# Altium schematic sheet Sheet3.SchDoc: =Name-1str
size 594 x 420 mm; SheetNumber: номер страницы; Вид изделия: Документация; Раздел: Документация; Код документа: Э3; Вид документа: Схема электрическая принципиальная; Класс документа: Конструкторский документ; Создавать изделие в PLM: Yes; DocumentCode: Э3; DocumentView: Схема электрическая принципиальная; DocumentClass: Конструкторский документ; ProductView: Документация
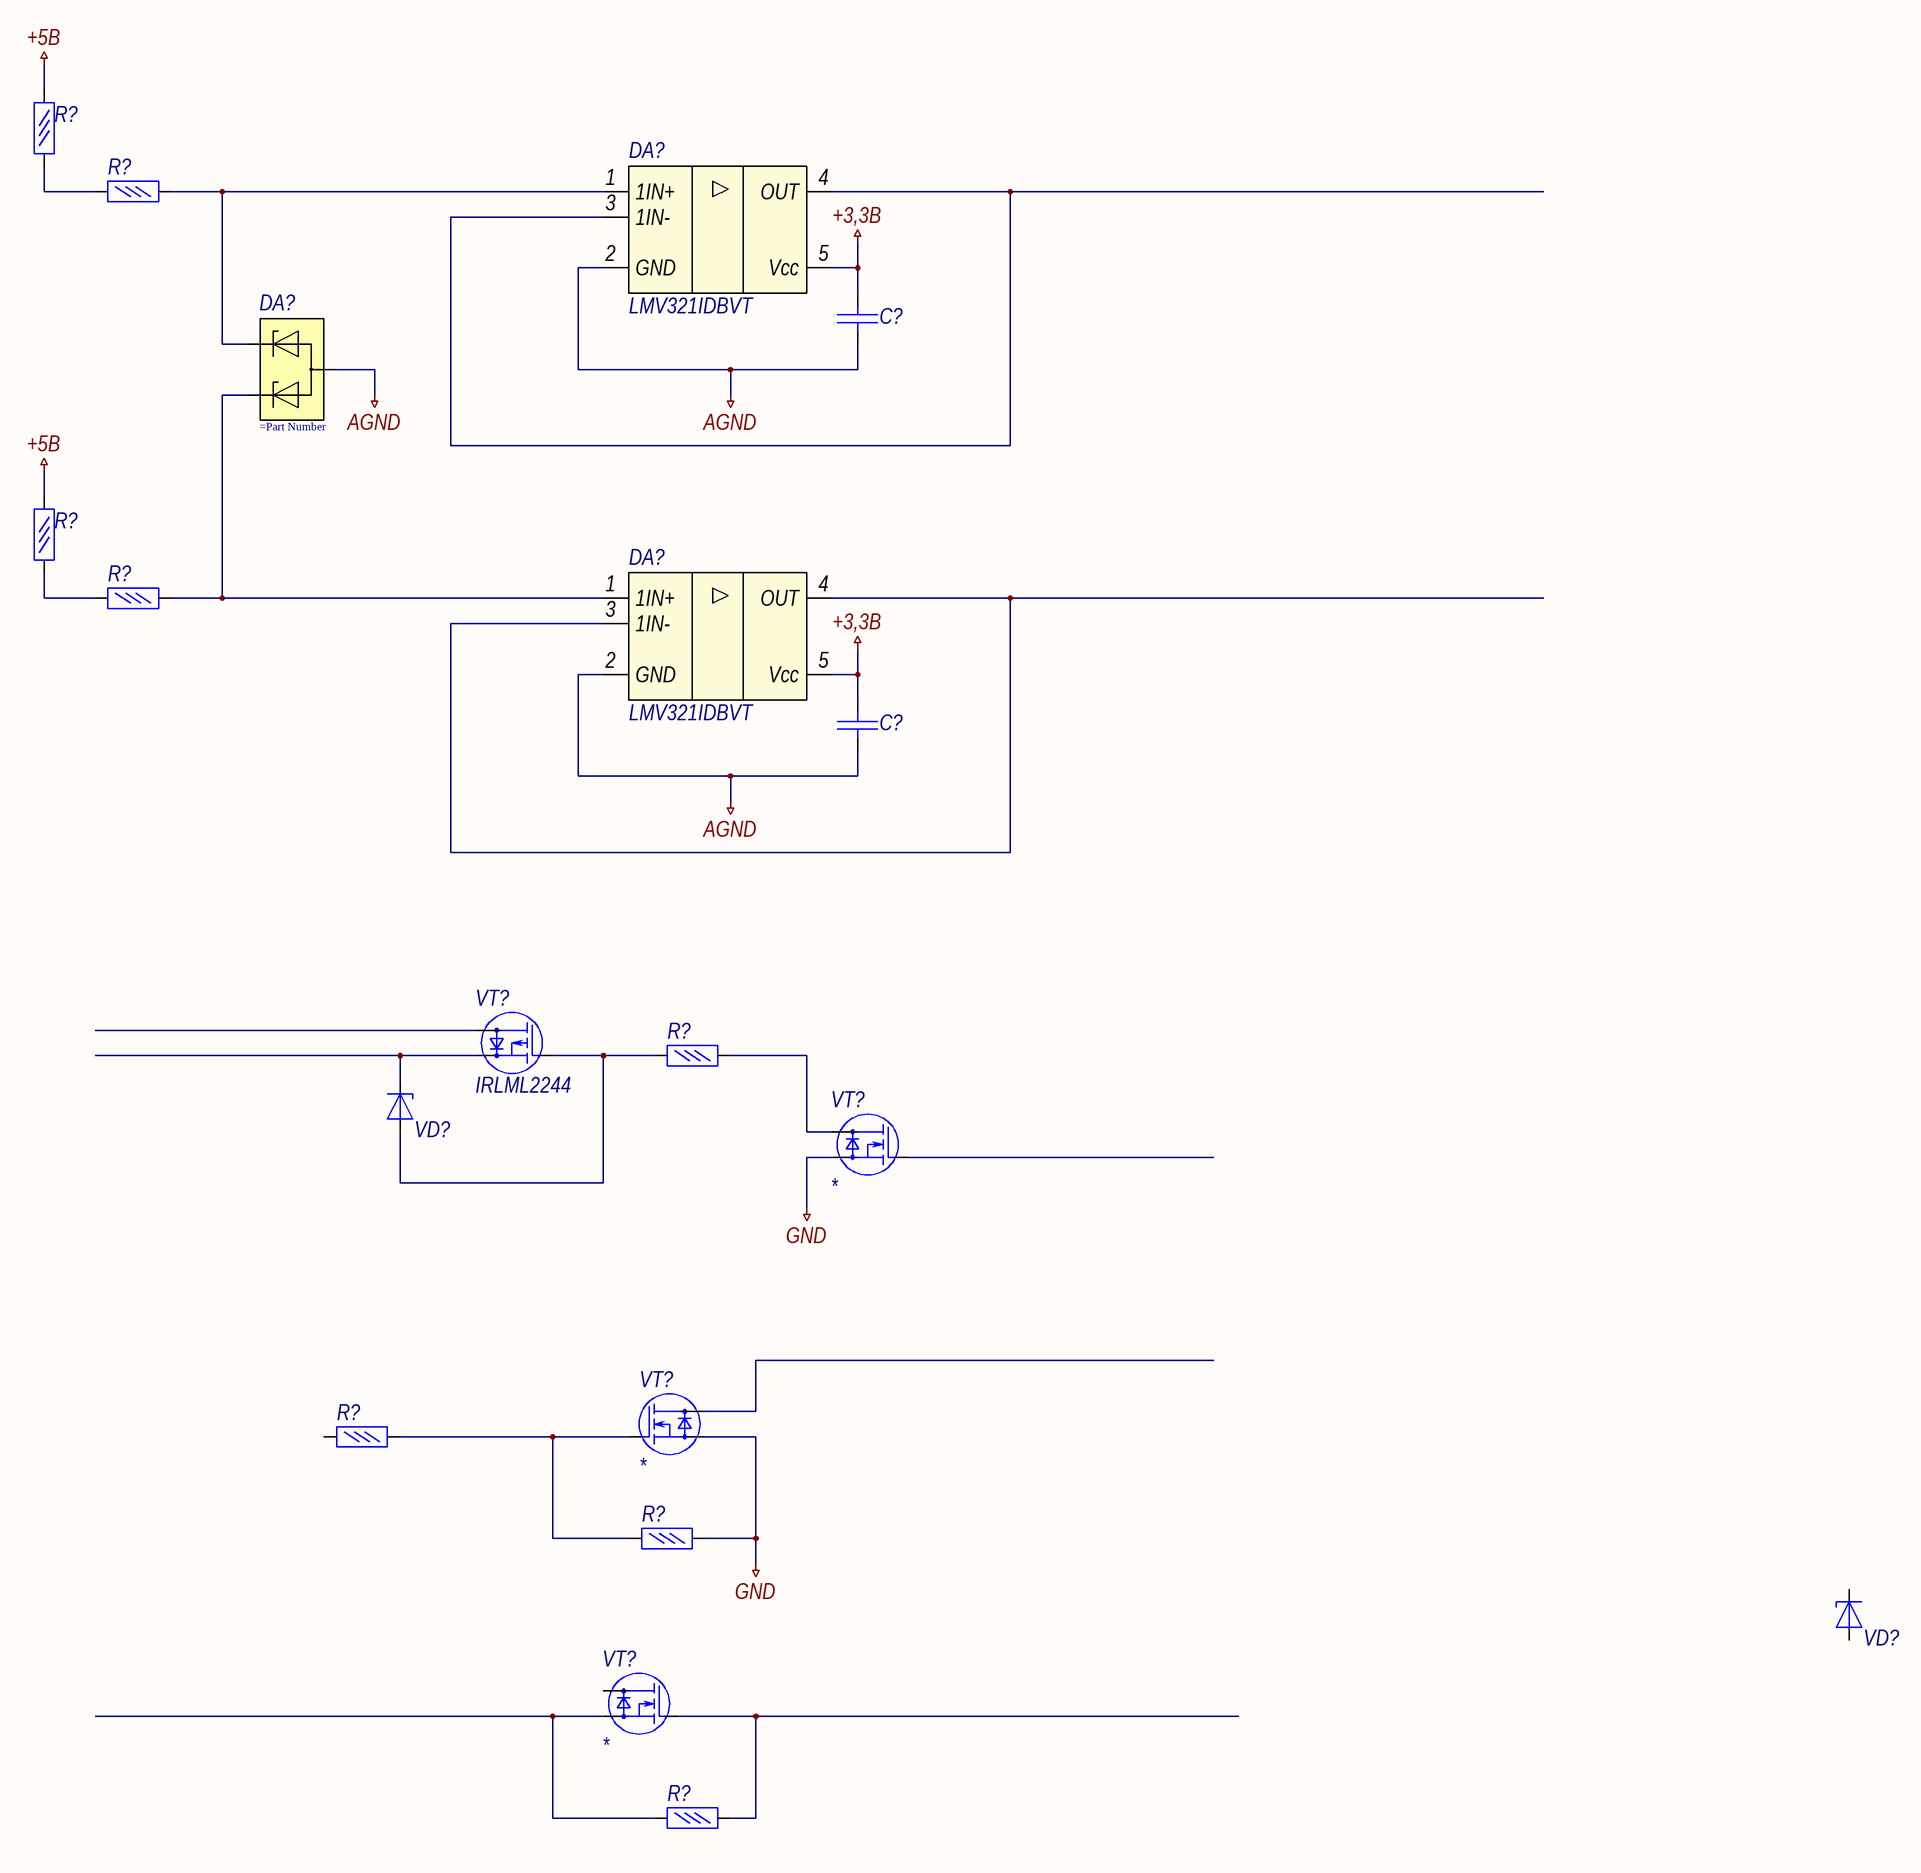
[diagram p0: Sheet3.SchDoc]

## Parts
(Parts that share a designator on the sheet are numbered #1, #2 ... from top to bottom, then left to right.)
C?#1  (no value)  [C0805_AA]
C?#2  (no value)  [C0805_AA]
DA?#1  LMV321IDBVT
DA?#2  (no value)
DA?#3  LMV321IDBVT
R?#1  (no value)  [R1206]
R?#2  (no value)  [R1206]
R?#3  (no value)  [R1206]
R?#4  (no value)  [R1206]
R?#5  (no value)  [R1206]
R?#6  (no value)  [R1206]
R?#7  (no value)  [R1206]
R?#8  (no value)  [R1206]
VD?#1  (no value)  [SOT23-2_A]
VD?#2  (no value)  [SOT23-2_A]
VT?#1  IRLML2244
VT?#2  *  [SOT23-3]
VT?#3  *  [SOT23-3]
VT?#4  *  [SOT23-3]

## Nets
+3,3В: C?#1.2 C?#2.2 DA?#1.5(Vcc) DA?#3.5(Vcc)
+5В: R?#1.2 R?#3.2
AGND: C?#1.1 C?#2.1 DA?#1.2(GND) DA?#2.3 DA?#3.2(GND)
GND: R?#7.1 VT?#2.2(S) VT?#3.2(S)
NetDA?#1_1: DA?#1.1(1IN+) DA?#2.2 R?#2.2
NetDA?#1_3: DA?#1.3(1IN-) DA?#1.4(OUT)
NetDA?#2_1: DA?#2.1 DA?#3.1(1IN+) R?#4.2
NetDA?#3_3: DA?#3.3(1IN-) DA?#3.4(OUT)
NetR?#1_1: R?#1.1 R?#2.1
NetR?#3_1: R?#3.1 R?#4.1
NetR?#5_1: R?#5.1 VD?#1.2(A) VT?#1.1(G)
NetR?#5_2: R?#5.2 VT?#2.3(D)
NetR?#6_2: R?#6.2 R?#7.2 VT?#3.1(G)
NetR?#8_1: R?#8.1 VT?#4.1(G)
NetR?#8_2: R?#8.2 VT?#4.2(S)
NetVD?#1_1: VD?#1.1(K) VT?#1.2(S)

Not connected (* = marked no-connect by the designer): R?#6 1; VD?#2 1(K) 2(A); VT?#1 3(D); VT?#2 1(G); VT?#3 3(D); VT?#4 3(D)

## Notes on the sheet
- Подп. и дата
- Инв. № дубл.
- Взам. инв. №
- Инв. № подл.
- Лист
- Изм.
- № докум.
- Подп.
- Дата
- Копировал
- Формат
- А2

## Library data of the parts
C?#1 C?#2 = Конденсатор кер.
DA?#1 DA?#3 = LMV321: Операционный усилитель Rail-to-rail
DA?#2 = ZenerArray2: Сборка TVS-диодов
R?#1-R?#8 = Резистор  0,05Вт: Резистор 0,05Вт; Power rating: 0,05Вт
VD?#1 VD?#2 = DiodeZener: Стабилитрон
VT?#1 = mosfet-p-1-3-2: Полевой P-канальный транзистор; Name: IRLML2244
VT?#2-VT?#4 = mosfet-n: Name: *